# EasyEDA Pro project DC_MOTOR_DRIVER_V2.0.epro

# Schematic sheet_2

## Sheets
1 Sheet_1
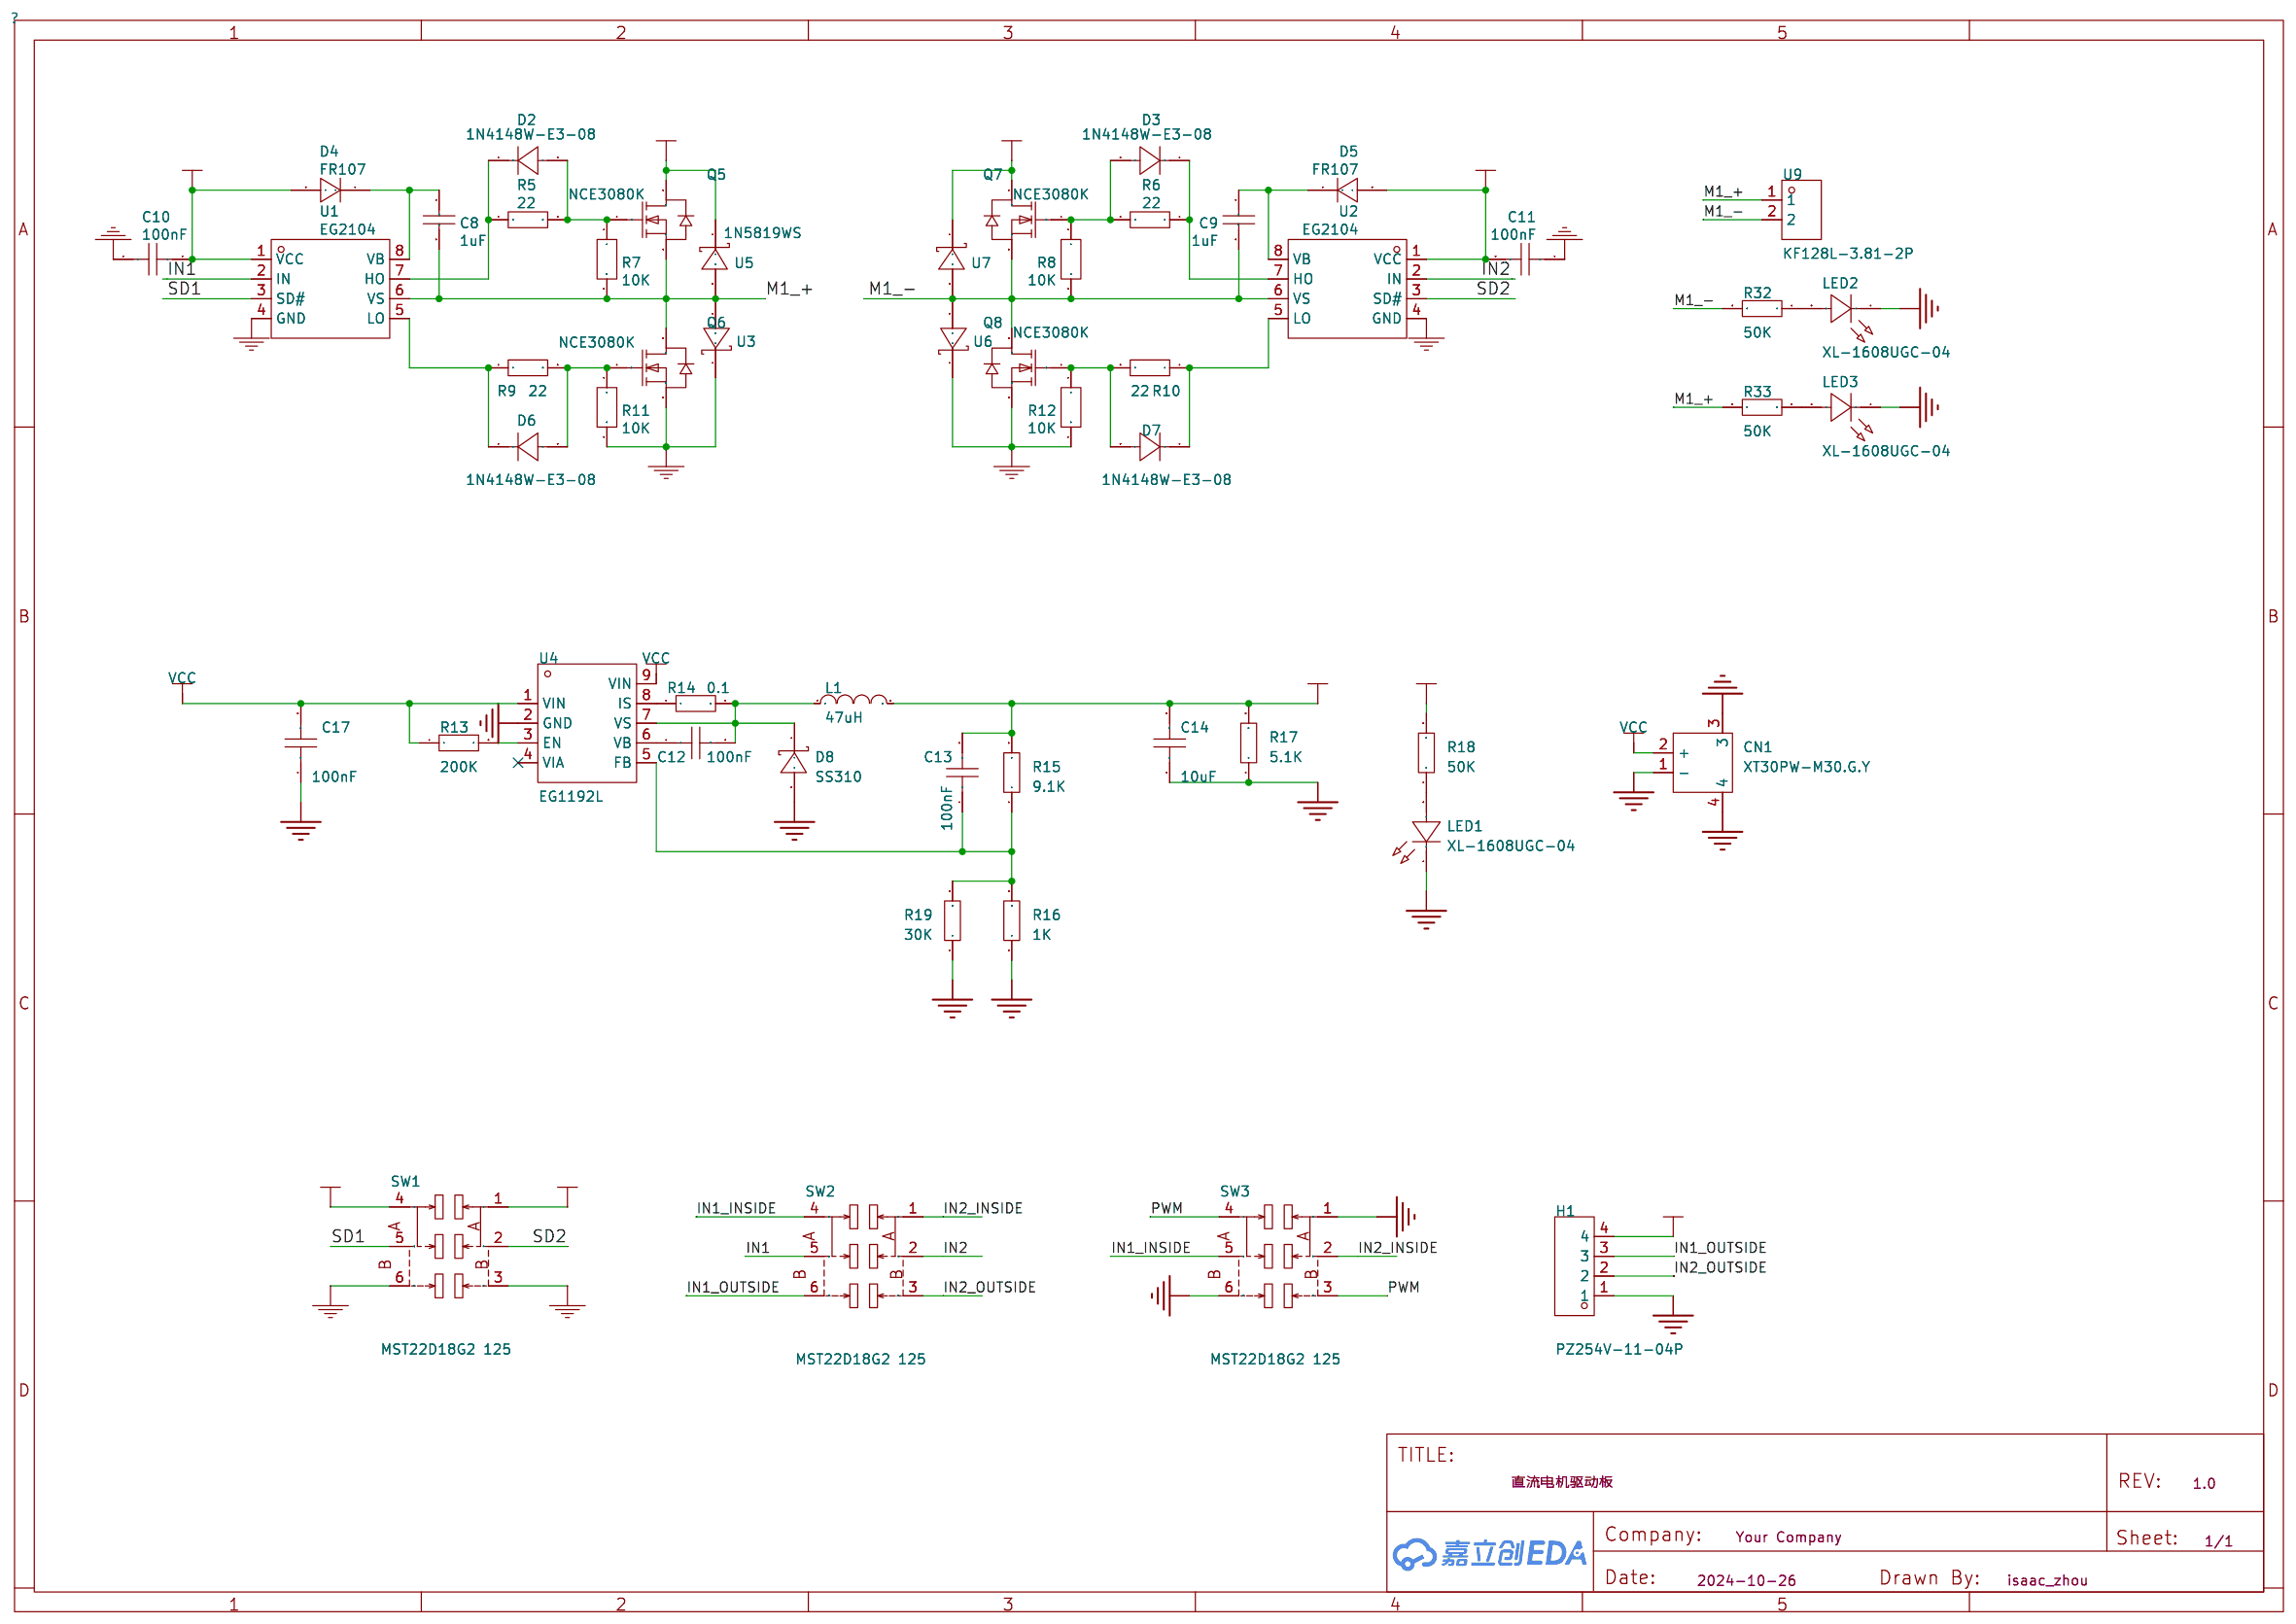
[diagram p0: Sheet_1]
2 PWM: Create Date: 2024-11-04; Page Name: PWM; Project Name: 直流电机驱动板; Schematic Name: New Project; Update Date: 2024-11-04; Company: 嘉立创EDA; Page Size: A4; Version: V1.0
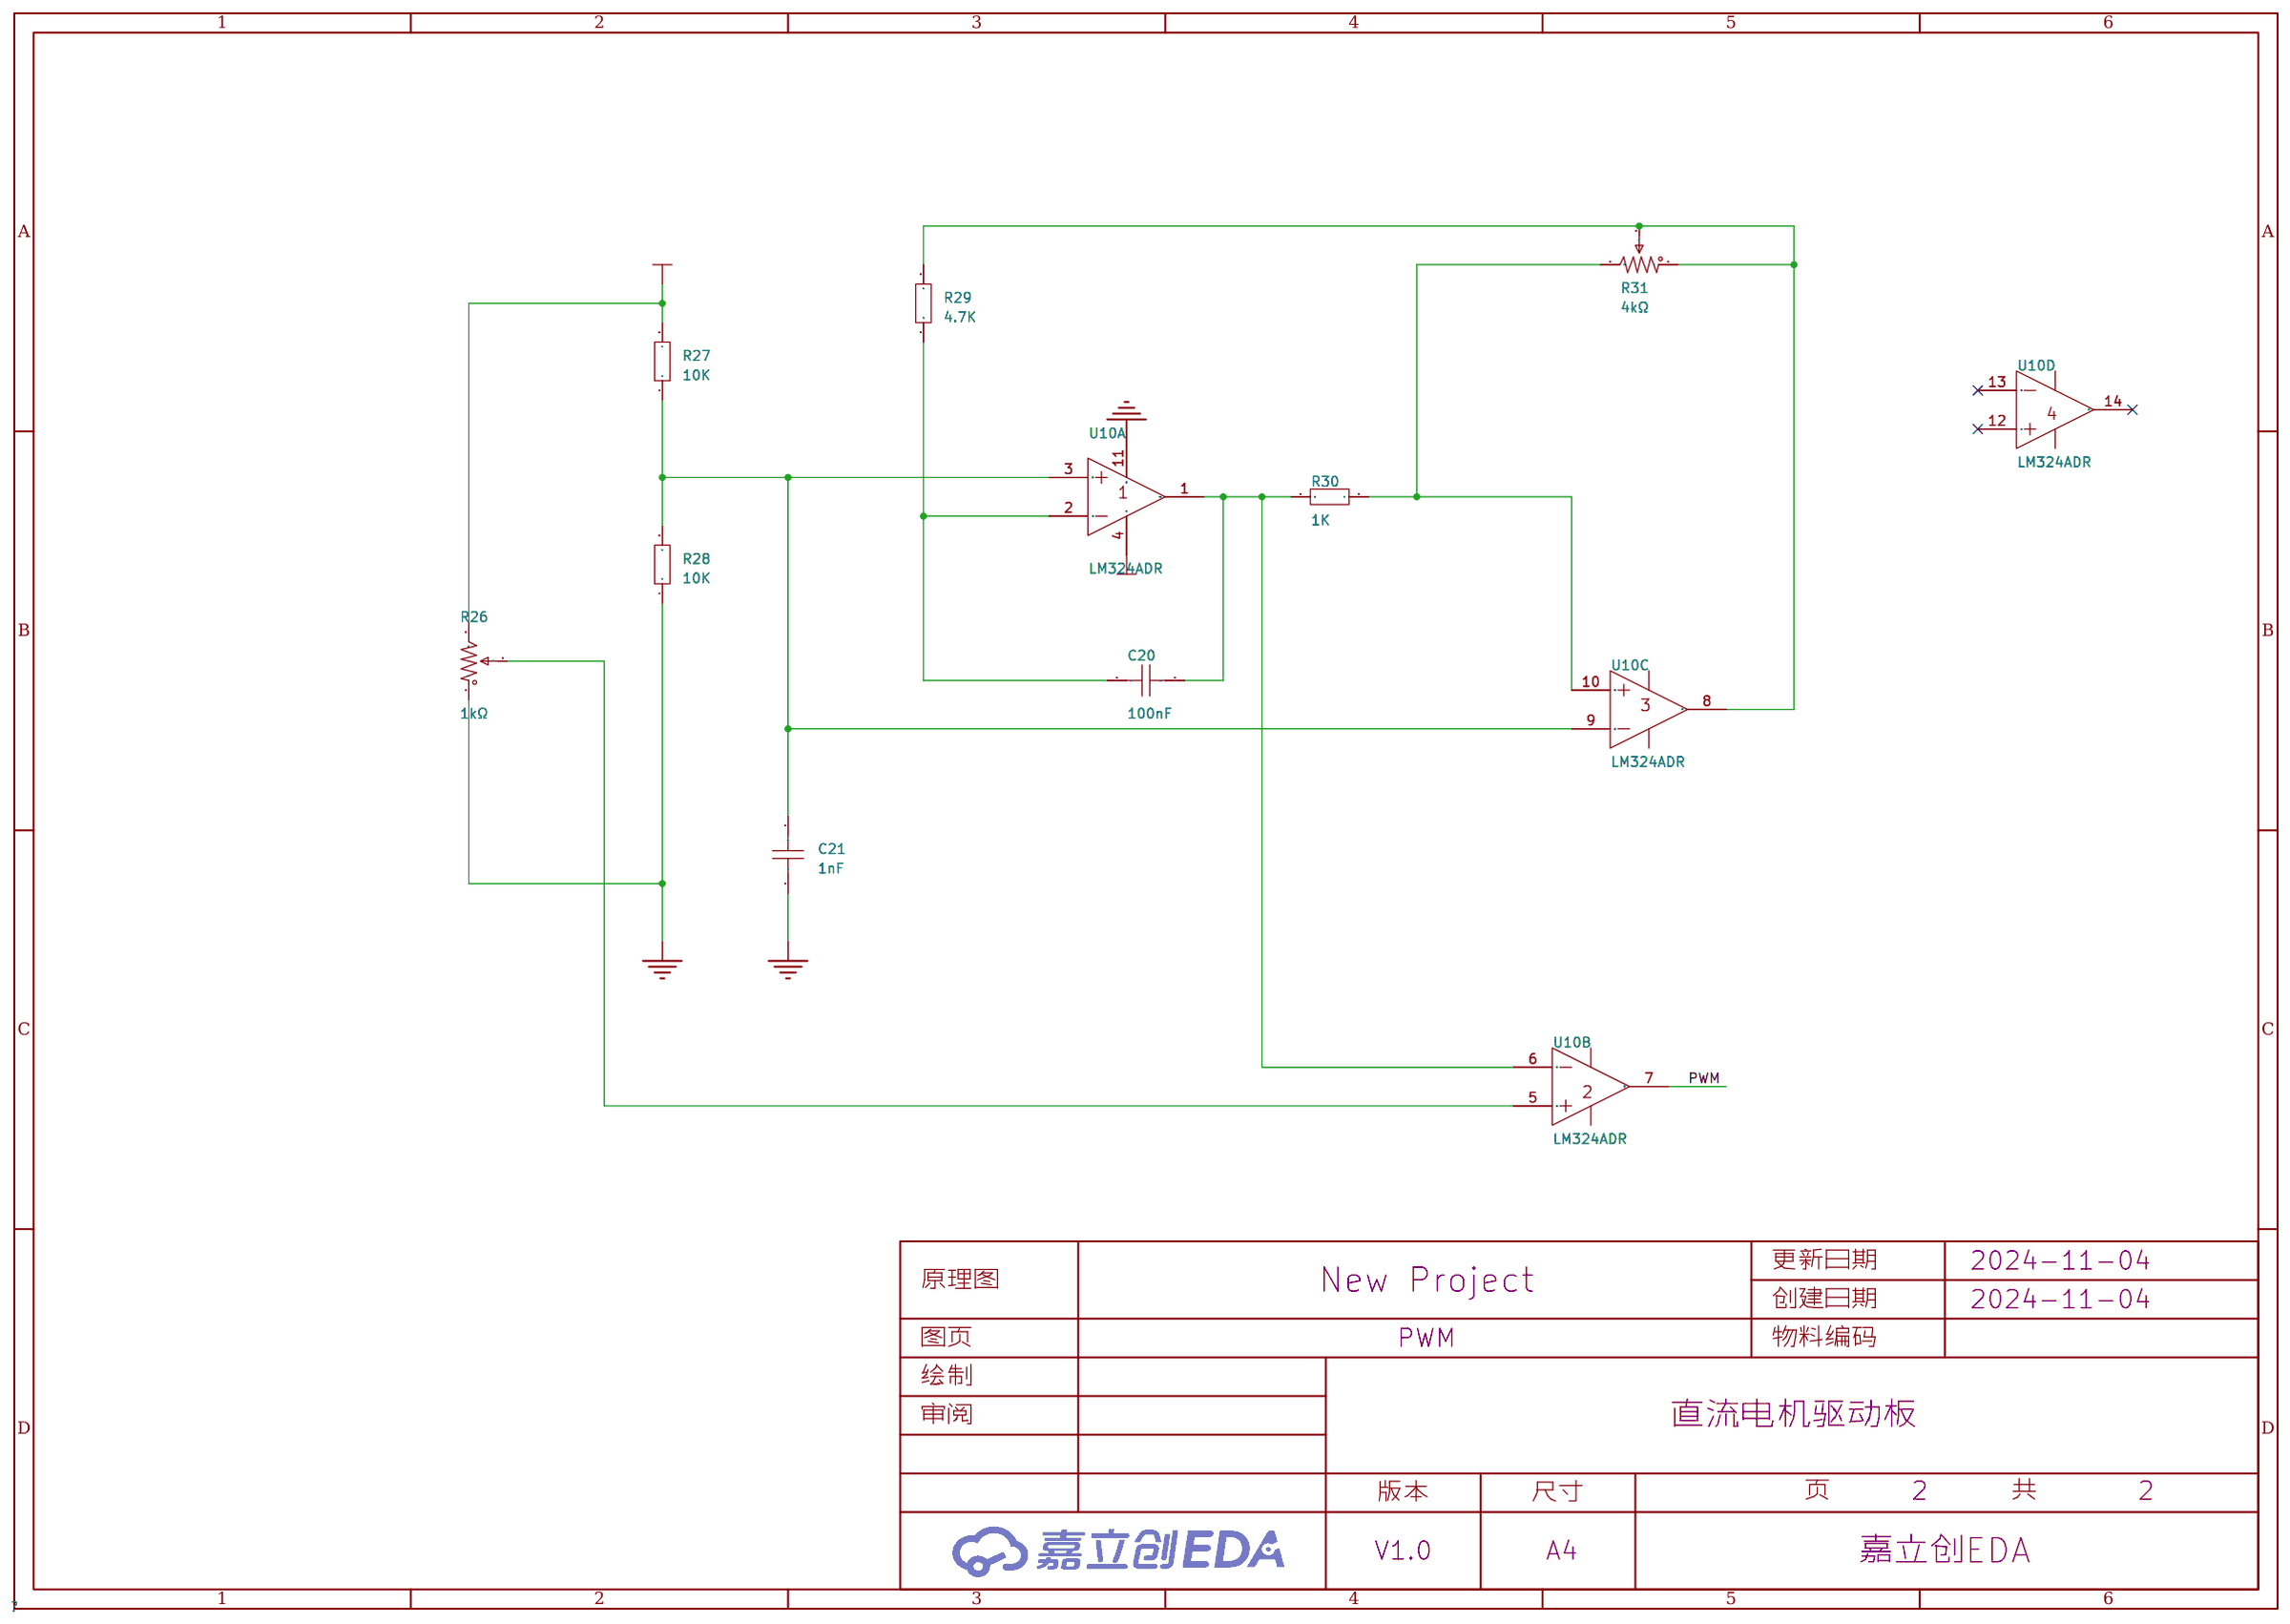
[diagram p1: PWM]

## Parts
sheet PWM
C20  100nF  [C0603]
C21  1nF  [C0603]
R26  1kΩ  [RES-ADJ-TH_3362P]
R27  10K  [R0603]
R28  10K  [R0603]
R29  4.7K  [R0603]
R30  1K  [R0603]
R31  4kΩ  [RES-ADJ-TH_3362P]
U10  LM324ADR  [SOP-14_L8.6-W3.9-P1.27-LS6.0-BL]  (sections 1,2,3,4)
sheet Sheet_1
C8  1uF  [C0603]
C9  1uF  [C0603]
C10  100nF  [C0603]
C11  100nF  [C0603]
C12  100nF  [C0603]
C13  100nF  [C0603]
C14  10uF  [C0603]
C17  100nF  [C0603]
CN1  XT30PW-M30.G.Y  [CONN-TH_XT30PW-M]
D2  1N4148W-E3-08  [SOD-123_L2.8-W1.8-LS3.7-RD]
D3  1N4148W-E3-08  [SOD-123_L2.8-W1.8-LS3.7-RD]
D4  FR107  [SOD-123FL_L2.7-W1.8-LS3.8-RD]
D5  FR107  [SOD-123FL_L2.7-W1.8-LS3.8-RD]
D6  1N4148W-E3-08  [SOD-123_L2.8-W1.8-LS3.7-RD]
D7  1N4148W-E3-08  [SOD-123_L2.8-W1.8-LS3.7-RD]
D8  SS310  [SMA_L4.3-W2.6-LS5.2-RD]
H1  PZ254V-11-04P  [HDR-TH_4P-P2.54-V-M]
L1  47uH  [IND-SMD_L7.3-W6.6]
LED1  XL-1608UGC-04  [LED0603-RD_GREEN]
LED2  XL-1608UGC-04  [LED0603-RD_GREEN]
LED3  XL-1608UGC-04  [LED0603-RD_GREEN]
Q5  NCE3080K  [TO-252-2_L6.6-W6.1-P4.57-LS9.9-TL-CW]
Q6  NCE3080K  [TO-252-2_L6.6-W6.1-P4.57-LS9.9-TL-CW]
Q7  NCE3080K  [TO-252-2_L6.6-W6.1-P4.57-LS9.9-TL-CW]
Q8  NCE3080K  [TO-252-2_L6.6-W6.1-P4.57-LS9.9-TL-CW]
R5  22  [R0603]
R6  22  [R0603]
R7  10K  [R0603]
R8  10K  [R0603]
R9  22  [R0603]
R10  22  [R0603]
R11  10K  [R0603]
R12  10K  [R0603]
R13  200K  [R0603]
R14  0.1  [R0603]
R15  9.1K  [R0603]
R16  1K  [R0603]
R17  5.1K  [R0603]
R18  50K  [R0603]
R19  30K  [R0603]
R32  50K  [R0603]
R33  50K  [R0603]
SW1  MST22D18G2 125  [SW-SMD_MST22D18G2]
SW2  MST22D18G2 125  [SW-SMD_MST22D18G2]
SW3  MST22D18G2 125  [SW-SMD_MST22D18G2]
U1  EG2104  [SOP-8_L5.0-W4.0-P1.27-LS6.2-BL]
U2  EG2104  [SOP-8_L5.0-W4.0-P1.27-LS6.2-BL]
U3  1N5819WS  [SOD-323_L1.8-W1.3-LS2.5-RD]
U4  EG1192L  [ESOP-8_L4.9-W3.9-P1.27-LS6.0-BL-EP]
U5  1N5819WS  [SOD-323_L1.8-W1.3-LS2.5-RD]
U6  1N5819WS  [SOD-323_L1.8-W1.3-LS2.5-RD]
U7  1N5819WS  [SOD-323_L1.8-W1.3-LS2.5-RD]
U9  KF128L-3.81-2P  [CONN-TH_P3.81_KF128L-3.81-2P]

## Library data of the parts
C14 C20 C21 = CAP_0603: Supplier Footprint: 0603
R26 R31 = 3362P-1-102: 阻值:1kΩ;精度:±10%;; LCSC Part Name: 1kΩ ±10%; Supplier Part: C118947; Manufacturer: BOCHEN(博晨); Supplier Footprint: 插件; JLCPCB Part Class: 扩展库; Datasheet: https://atta.szlcsc.com/upload/public/pdf/source/20171114/C118947_15106326631901117436.pdf; Supplier: LCSC; Tolerance: ±10%
R13 R17 R27-R30 = Res_0603: Supplier Footprint: 0603
U10 = LM324ADR_C2837469: Supplier Part: C2837469; Manufacturer: UMW(友台半导体); Supplier Footprint: SOP-14; JLCPCB Part Class: 扩展库; Datasheet: https://atta.szlcsc.com/upload/public/pdf/source/20240802/7FC25ED9797EBD5FD4F47818FEC11BE7.pdf; Supplier: LCSC
C8 C9 = 1uF: Supplier: LCSC; Manufacturer Part: CL21F105ZOFNNNE; Manufacturer: SAMSUNG; Supplier Part: C14663; JLCPCB Part Class: Extended Part
C10 = 100nF: Supplier: LCSC; Supplier Part: C599851; Manufacturer: KEMET; Manufacturer Part: C0805C104K4RAC7800
C11 = 100nF: Supplier: LCSC; Supplier Part: C14663; Manufacturer: KEMET; Manufacturer Part: C0805C104K4RAC7800
C12 C13 C17 = CAP_0603: Supplier Footprint: 0603; Supplier Part: C14663
CN1 = XT30PW-M30.G.Y: 类别:-;类型1:-;; LCSC Part Name: AMASS(艾迈斯)航模插头 卧式弯脚 XT30PW-M公头; Supplier Part: C431092; Manufacturer: AMASS(艾迈斯); JLCPCB Part Class: 扩展库; Datasheet: https://atta.szlcsc.com/upload/public/pdf/source/20220222/6A9F22F7850E25B33E1BE430ADF8560B.pdf; Supplier: LCSC; Type: 航模插头; RatedVoltage: DC 500V; InterfaceType: 公头; RatedCurrent: 15A; RecommendedWireGauge: 16/18/20AWG; contact resistance: 1.2mΩ; specifications: 2pin
D2 D3 D6 D7 = 1N4148W-E3-08: 二极管配置:-;正向压降(Vf):1.2V@100mA;直流反向耐压(Vr):75V;平均整流电流(Io):150mA;功率:350mW;反向恢复时间(trr):4ns;; LCSC Part Name: 电压:75V 电流:150mA; Supplier Part: C241939; Manufacturer: VISHAY(威世); Supplier Footprint: SOD-123; JLCPCB Part Class: Extended Part; Datasheet: https://atta.szlcsc.com/upload/public/pdf/source/20180719/C241939_AB5601D33C939ACDC04F46818C9B4736.pdf; Supplier: LCSC; Forward Voltage (Vf@If): 1.2V@100mA; Reverse Voltage (Vr): 75V; Average Rectified Current (Io): 150mA; Power Dissipation: 350mW; Reverse Leakage Current: 100uA@100V; Reverse Recovery Time (trr): 4ns
D4 D5 = FR107_C2760867: 二极管配置:独立式;正向压降(Vf):1.3V@1A;直流反向耐压(Vr):1kV;平均整流电流(Io):1A;反向恢复时间(trr):500ns;; LCSC Part Name: 电压:1kV 电流:1A; Supplier Part: C2760867; Manufacturer: Slkor(萨科微); Supplier Footprint: SOD-123FL; JLCPCB Part Class: Extended Part; Datasheet: https://atta.szlcsc.com/upload/public/pdf/source/20210316/C2760867_0B45AFF5F62837EEEC945A80EBBE02AA.pdf; Supplier: LCSC; Diode Configuration: 独立式; Forward Voltage (Vf@If): 1.3V@1A; Reverse Voltage (Vr): 1kV; Average Rectified Current (Io): 1A; Reverse Leakage Current: 5uA@1kV; Reverse Recovery Time (trr): 500ns; Operating Temperature: -55℃~+150℃@(Tj)
D8 = SS310_C15874: 二极管配置:独立式;正向压降(Vf):850mV@3A;直流反向耐压(Vr):100V;整流电流:3A;; LCSC Part Name: 电压:100V 电流:3A; Supplier Part: C15874; Manufacturer: MDD(辰达半导体); Supplier Footprint: SMA(DO-214AC); JLCPCB Part Class: 扩展库; Datasheet: https://atta.szlcsc.com/upload/public/pdf/source/20230314/A80AE34493C69B89E2F4B1712F433538.pdf; Supplier: LCSC; Diode Configuration: 独立式; Forward Voltage (Vf@If): 850mV@3A; Reverse Voltage (Vr): 100V; Rectified Current: 3A; Reverse Leakage Current (Ir): 500uA@100V
H1 = PZ254V-11-04P: 插针结构:1x4P;间距:2.54mm;行距:-;圆针/方针:方针;安装类型:直插;排数:单排;总PIN位数:4P;额定电流:3A;额定电压:250V;配合针长度:6mm;塑高:2.5mm;端接针长度:3mm;触头材质:-;工作温度范围:-40℃~+105℃;颜色:黑色;; LCSC Part Name: 间距:2.54mm 1x4P 直插 方针; Supplier Part: C2691448; Manufacturer: XFCN(兴飞); Supplier Footprint: 插件,P=2.54mm; JLCPCB Part Class: 扩展库; Datasheet: https://atta.szlcsc.com/upload/public/pdf/source/20200309/C492403_F9F19131791D08044AD4F84F8E751A34.pdf; Supplier: LCSC; Pin Structure: 1x4P; Pitch: 2.54mm; Circluar Pins/Square Pins: 方针; Mounting Type: 直插; Number of Rows: 单排; Number of Pins: 4P; Current Rating (Max): 3A; Voltage Rating (Max): 250V; Length of Mating Pin: 6mm; Insulation Height: 2.5mm; Length of End Connection Pin: 3mm; Operating Temperature Range: -40℃~+105℃; Color: 黑色
L1 = CKST0603-47uH/M: 电感值:47uH;精度:±20%;类型:一体成型电感;; LCSC Part Name: 47uH ±20%; Supplier Part: C3002643; Manufacturer: CENKER(岑科); Supplier Footprint: 0603; JLCPCB Part Class: Extended Part; Datasheet: https://atta.szlcsc.com/upload/public/pdf/source/20220510/B48FE89972EB9627500571FF6CB43AFA.pdf; Supplier: LCSC; Tolerance: ±20%; Type: 一体成型电感
LED1-LED3 = XL-1608UGC-04: 灯头类型:-;发光颜色:翠绿色;正向电压(VF):-;功率:80mW;正向电流:25mA;主波长:516nm~525nm;二极管配置:独立二极管;透镜颜色:无色透明透镜;色温:-;发光强度:-;发光角度:120°;载带方式:正贴;工作温度:-30℃~+85℃;; Supplier Part: C965804; Manufacturer: XINGLIGHT(成兴光); Supplier Footprint: 0603; JLCPCB Part Class: 扩展库; Datasheet: https://atta.szlcsc.com/upload/public/pdf/source/20221102/520D6E465E5CFD1609C8A4DBC80D4018.pdf; Supplier: LCSC; Emitted Color: 翠绿色; Power Dissipation: 80mW; Forward Current: 25mA; Dominant Wavelength: 516nm~525nm; Peak Wavelength: 534nm; Diode Configuration: 独立二极管; Lens Color: 无色透明透镜; Viewing Angle: 120°; Mounting Sytle: 正贴; Operating Temperature: -30℃~+85℃
Q5-Q8 = NCE3080K: 类型:N沟道;漏源电压(Vdss):30V;连续漏极电流(Id):80A;功率(Pd):83W;导通电阻(RDS(on)@Vgs,Id):6.5mΩ@10V,30A;阈值电压(Vgs(th)@Id):3V@250uA;; LCSC Part Name: N沟道 耐压:30V 电流:80A; Supplier Part: C108901; Manufacturer: NCE(无锡新洁能); Supplier Footprint: TO-252-2(DPAK); JLCPCB Part Class: Extended Part; Datasheet: https://atta.szlcsc.com/upload/public/pdf/source/20170505/1493957853878.pdf; Supplier: LCSC; Type: N沟道; Drain Source Voltage (Vdss): 30V; Continuous Drain Current (Id): 80A; Power Dissipation (Pd): 83W; Drain Source On Resistance (RDS(on)@Vgs,Id): 6.5mΩ@10V,30A; Gate Threshold Voltage (Vgs(th)@Id): 3V@250uA
R5 R9 = 22: Supplier: LCSC; Manufacturer: UniOhm; Manufacturer Part: 0805W8F220JT5E; Supplier Part: C17561; JLCPCB Part Class: Basic Part
R6 R10 = 22: Supplier: LCSC; Manufacturer: UniOhm; Manufacturer Part: 0805W8F220JT5E; Supplier Part: C21190; JLCPCB Part Class: Basic Part
R7 R8 R11 R12 = 10K: Supplier: LCSC; Supplier Part: C21190; Manufacturer: Uniroyal Elec; Manufacturer Part: 0805W8F1002T5E; JLCPCB Part Class: Extended Part
R14-R16 R18 R19 R32 R33 = Res_0603: Supplier Footprint: 0603; Supplier Part: C21190
SW1-SW3 = MST22D18G2 125: 电路结构:双刀双掷;安装方式:立贴;开关颜色:黑色;额定电流(DC):100mA;额定电压(DC):12V;机械寿命:1万次;; LCSC Part Name: 拨动开关/两档立式 6脚贴片 柄长2.0mm 大六立贴 9.1*3.5mm; Supplier Part: C2906280; Manufacturer: SHOU HAN(首韩); Supplier Footprint: SMD; JLCPCB Part Class: 扩展库; Datasheet: https://atta.szlcsc.com/upload/public/pdf/source/20211019/449AD4EDF23AADA7A5C4E3C063EDBB30.pdf; Supplier: LCSC; Circuit: 双刀双掷; Pin Style: 鸥翼型; Mounting Style: 立贴; Actuator Color: 黑色; Current Rating (DC): 100mA; Voltage Rating (DC): 12V; Mechanical Life: 1万次; Operating Temperature: -25℃~+70℃
U1 U2 = EG2104: 高性价比, 600V，半桥式Nmos预驱动器; Supplier Part: C186697; Manufacturer: EG(屹晶微); Supplier Footprint: SOP-8; JLCPCB Part Class: Extended Part; Datasheet: https://atta.szlcsc.com/upload/public/pdf/source/20220627/4CCFA0CAB664067FEE4AF87E4129127F.pdf; Supplier: LCSC
U3 U5-U7 = 1N5819WS_C191023: 正向压降(Vf):600mV@1A;直流反向耐压(Vr):40V;平均整流电流(Io):1A;; LCSC Part Name: 电压:40V 电流:1A; Supplier Part: C191023; Manufacturer: Hottech(合科泰); Supplier Footprint: SOD-323; JLCPCB Part Class: Basic Part; Datasheet: https://atta.szlcsc.com/upload/public/pdf/source/20220428/3CB86FD8D28D653594B4E35F9D5AEFD9.pdf; Supplier: LCSC; Forward Voltage (Vf@If): 600mV@1A; Reverse Voltage (Vr): 40V; Average Rectified Current (Io): 1A
U4 = EG1192L: 零功耗使能降压 DCDC 电源芯片; LCSC Part Name: 零功耗使能降压 DCDC 电源芯片; Supplier Part: C2987436; Manufacturer: EG(屹晶微); Supplier Footprint: ESOP-8; JLCPCB Part Class: 扩展库; Datasheet: https://atta.szlcsc.com/upload/public/pdf/source/20220401/C4C4A2A7D21C9FC2776ECF40A6ED664C.pdf; Supplier: LCSC
U9 = KF128L-3.81-2P: 结构:1x2P;间距:3.81mm;颜色:绿色;安装方式:直插;额定电流:10A;额定电压:300V;排数:1;线规 - AWG:16~26;线规 - 平方毫米:1;每排PIN数:2;工作温度范围:-40℃~+105℃;; LCSC Part Name: 3.81mm 1x2P 排数:1 每排P数:2 直插; Supplier Part: C474932; Manufacturer: KEFA(科发); Supplier Footprint: 插件,P=3.81mm; JLCPCB Part Class: 扩展库; Datasheet: https://atta.szlcsc.com/upload/public/pdf/source/20240118/B0177BAB216696F90B0D16B51EF273F7.pdf; Supplier: LCSC; Structure: 1x2P; Pitch: 3.81mm; Color: 绿色; Mounting Style: 直插; Current Rating (Max): 10A; Voltage Rating (Max): 300V; Number of Pins: 2P; Number of Rows: 1; Wire Gauge - AWG: 16~26; Wire Gauge - mm2: 1; Number of PINs Per Row: 2; Operating Temperature Range: -40℃~+105℃

## Nets
12V: C10.2 C11.2 C13.2 C14.2 D4.2(A) D5.2(A) H1.4 L1.2 Q5.2(D) Q7.2(D) R15.2 R17.2 R18.2 R26.3 R27.2 SW1.1 SW1.4 U1.1(VCC) U2.1(VCC) U5.1(K) U7.1(K) U10.4(VCC)
GND: C10.1 C11.1 C14.1 C17.1 C21.1 CN1.1(-) CN1.3 CN1.4 D8.2(A) H1.1 LED1.1(K) LED2.1(K) LED3.1(K) Q6.3(S) Q8.3(S) R11.2 R12.2 R16.1 R17.1 R19.1 R26.1 R28.1 SW1.3 SW1.6 SW3.1 SW3.6 U1.4(GND) U2.4(GND) U3.1(K) U4.2(GND) U6.1(K) U10.11(GND)
VCC: C17.2 CN1.2(+) R13.1 U4.1(VIN) U4.9(VIN)
IN1: SW2.5 U1.2(IN)
IN1_INSIDE: SW2.4 SW3.5
IN1_OUTSIDE: H1.3 SW2.6
IN2: SW2.2 U2.2(IN)
IN2_INSIDE: SW2.1 SW3.2
IN2_OUTSIDE: H1.2 SW2.3
M1_+: C8.2 Q5.3(S) Q6.2(D) R7.2 R33.2 U1.6(VS) U3.2(A) U5.2(A) U9.1
M1_-: C9.2 Q7.3(S) Q8.2(D) R8.2 R32.2 U2.6(VS) U6.2(A) U7.2(A) U9.2
PWM: SW3.3 SW3.4 U10.7(2OUT)
SD1: SW1.5 U1.3(SD#)
SD2: SW1.2 U2.3(SD#)
$1N6: C9.1 D5.1(K) U2.8(VB)
$1N7: D3.1(K) R6.1 U2.7(HO)
$1N8: D3.2(A) Q7.1(G) R6.2 R8.1
$1N10: D7.1(K) R10.1 U2.5(LO)
$1N13: D7.2(A) Q8.1(G) R10.2 R12.1
$1N16: D6.2(A) Q6.1(G) R9.2 R11.1
$1N17: C8.1 D4.1(K) U1.8(VB)
$1N19: D6.1(K) R9.1 U1.5(LO)
$1N20: D2.2(A) Q5.1(G) R5.2 R7.1
$1N21: D2.1(K) R5.1 U1.7(HO)
$1N1054: R13.2 U4.3(EN)
$1N1080: R14.1 U4.8(IS)
$1N1130: C12.1 U4.6(VB)
$1N1292: C12.2 D8.1(K) L1.1 R14.2 U4.7(VS)
$1N2120: LED1.2(A) R18.1
$1N2220: C13.1 R15.1 R16.2 R19.2 U4.5(FB)
$1N11802: LED2.2(A) R32.1
$1N11897: LED3.2(A) R33.1
$2N434: R26.2 U10.5(2IN+)
$2N438: R29.2 R31.1 R31.2 U10.8(3OUT)
$2N446: R30.1 R31.3 U10.10(3IN+)
$2N452: C20.2 R30.2 U10.1(1OUT) U10.6(2IN-)
$2N464: C21.2 R27.1 R28.2 U10.3(1IN+) U10.9(3IN-)
$2N473: C20.1 R29.1 U10.2(1IN-)

Not connected (* = marked no-connect by the designer): U4 4(VIA)*; U10 12(4IN+)* 13(4IN-)* 14(4OUT)*

# Board PCB1
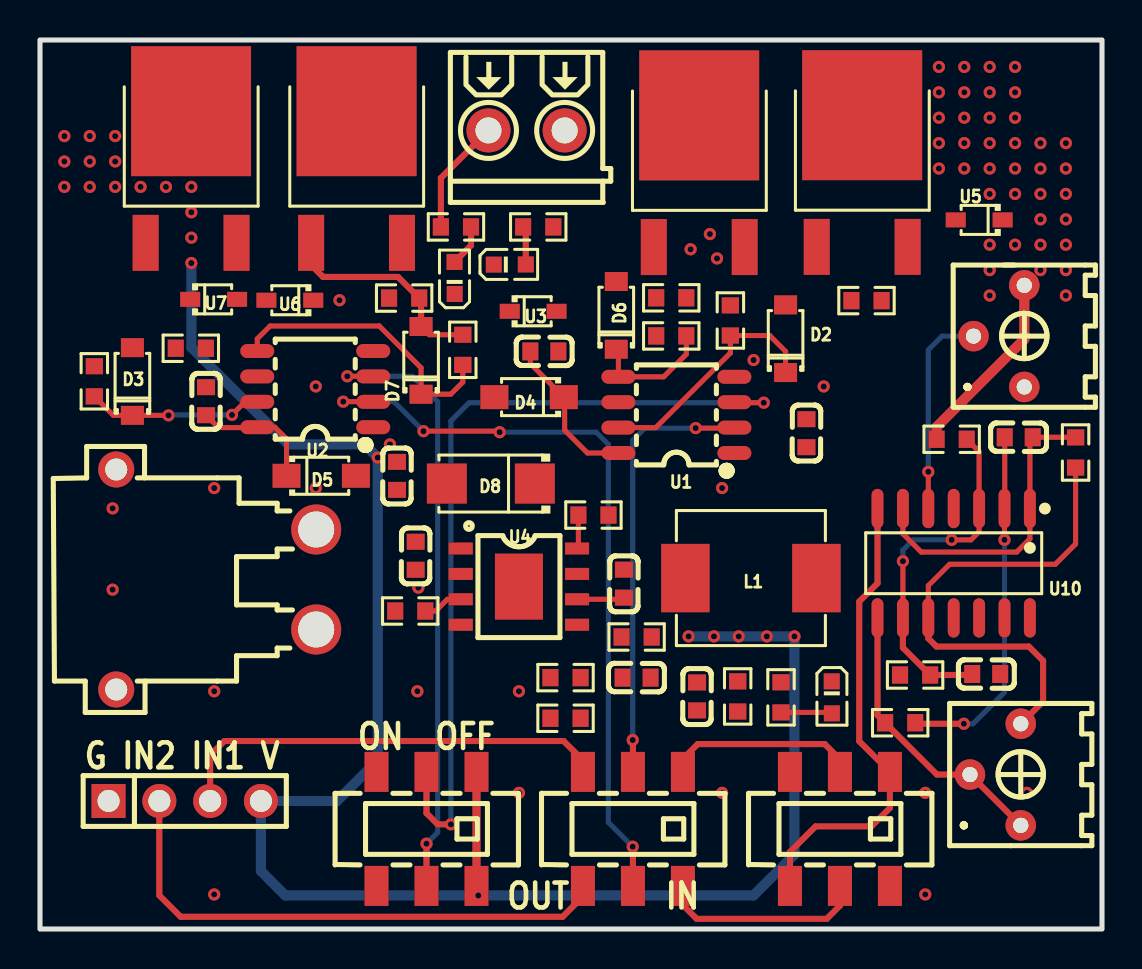
[diagram p2: board, top side]
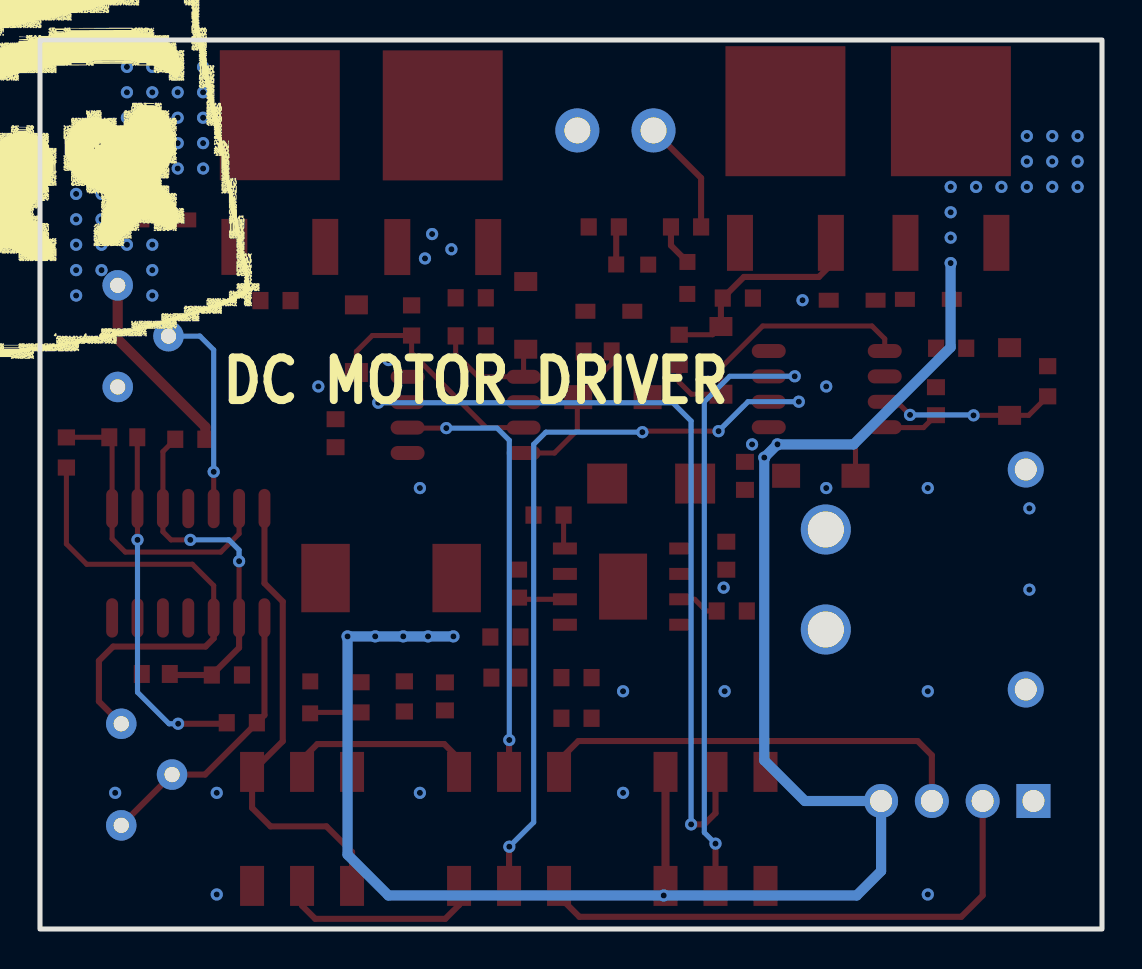
[diagram p3: board, bottom side, seen from below]

Outline 53.11 x 44.45 mm; copper layers: Top Layer, Bottom Layer. Coordinates in mm from the lower left corner of the outline.
Outline path: rectangle 0,44.45 53.11,0
Stack: Top Layer 0.035mm / Dielectric1 1.51mm FR4 er 4.5 / Bottom Layer 0.035mm

## Design rules (mm)
template: 自定义配置
spacing copperThickness1oz (default): track to track 0.102, other pairs 0.152 to 0.3
spacing copperThickness2oz: track to track 0.203, other pairs 0.152 to 0.3
track width copperThickness1oz (default): min 0.127, default 0.254, max 2.54
track width copperThickness2oz: min 0.203, default 0.254, max 2.54
differential pair differentialPair (default): width min 0.127, default 0.254, max 2.54; gap min 0.152, default 0.152
via viaSize (default): diameter min 0.5, default 0.61, max 10; hole min 0.3, default 0.305, max 6.3

## Placement (name value [footprint] x y rotation side)
C8  1uF  [C0603]  25.22 28.88 0 top
C9  1uF  [C0603]  8.31 26.39 90 top
C10  100nF  [C0603]  38.33 24.79 270 top
C11  100nF  [C0603]  17.86 22.66 90 top
C12  100nF  [C0603]  29.2 17.27 90 top
C13  100nF  [C0603]  29.84 12.57 0 top
C14  10uF  [C0603]  32.86 11.63 90 top
C17  100nF  [C0603]  18.79 18.66 90 top
C20  100nF  [C0603]  48.95 24.59 0 top
C21  1nF  [C0603]  47.32 12.75 180 top
CN1  XT30PW-M30.G.Y  [CONN-TH_XT30PW-M]  8.81 17.48 270 top
D2  1N4148W-E3-08  [SOD-123_L2.8-W1.8-LS3.7-RD]  37.29 29.52 90 top
D3  1N4148W-E3-08  [SOD-123_L2.8-W1.8-LS3.7-RD]  4.62 27.37 90 top
D4  FR107  [SOD-123FL_L2.7-W1.8-LS3.8-RD]  24.46 26.59 180 top
D5  FR107  [SOD-123FL_L2.7-W1.8-LS3.8-RD]  14.06 22.66 0 top
D6  1N4148W-E3-08  [SOD-123_L2.8-W1.8-LS3.7-RD]  28.82 30.68 90 top
D7  1N4148W-E3-08  [SOD-123_L2.8-W1.8-LS3.7-RD]  19.06 28.43 90 top
D8  SS310  [SMA_L4.3-W2.6-LS5.2-RD]  22.55 22.27 180 top
H1  PZ254V-11-04P  [HDR-TH_4P-P2.54-V-M]  7.24 6.4 0 top
L1  47uH  [IND-SMD_L7.3-W6.6]  35.55 17.55 180 top
LED1  XL-1608UGC-04  [LED0603-RD_GREEN]  39.6 11.58 270 top
LED2  XL-1608UGC-04  [LED0603-RD_GREEN]  20.74 32.55 90 top
LED3  XL-1608UGC-04  [LED0603-RD_GREEN]  23.5 33.22 0 top
Q5  NCE3080K  [TO-252-2_L6.6-W6.1-P4.57-LS9.9-TL-CW]  41.12 37.4 90 top
Q6  NCE3080K  [TO-252-2_L6.6-W6.1-P4.57-LS9.9-TL-CW]  32.97 37.39 90 top
Q7  NCE3080K  [TO-252-2_L6.6-W6.1-P4.57-LS9.9-TL-CW]  7.56 37.6 90 top
Q8  NCE3080K  [TO-252-2_L6.6-W6.1-P4.57-LS9.9-TL-CW]  15.83 37.6 90 top
R5  22  [R0603]  34.53 30.43 90 top
R6  22  [R0603]  2.72 27.39 90 top
R7  10K  [R0603]  41.33 31.42 0 top
R8  10K  [R0603]  7.54 29.04 0 top
R9  22  [R0603]  31.57 29.65 180 top
R10  22  [R0603]  21.14 28.96 90 top
R11  10K  [R0603]  31.57 31.56 0 top
R12  10K  [R0603]  18.21 31.55 180 top
R13  200K  [R0603]  18.52 15.9 0 top
R14  0.1  [R0603]  27.68 20.7 0 top
R15  9.1K  [R0603]  29.84 14.6 0 top
R16  1K  [R0603]  26.28 10.54 0 top
R17  5.1K  [R0603]  34.89 11.63 90 top
R18  50K  [R0603]  37.06 11.58 90 top
R19  30K  [R0603]  26.28 12.57 0 top
R26  1kΩ  [RES-ADJ-TH_3362P]  47.96 29.64 90 top
R27  10K  [R0603]  45.59 24.49 180 top
R28  10K  [R0603]  43.76 12.7 0 top
R29  4.7K  [R0603]  43.02 10.31 180 top
R30  1K  [R0603]  51.79 23.83 90 top
R31  4kΩ  [RES-ADJ-TH_3362P]  47.78 7.72 90 top
R32  50K  [R0603]  20.8 35.1 180 top
R33  50K  [R0603]  24.92 35.1 0 top
SW1  MST22D18G2 125  [SW-SMD_MST22D18G2]  19.33 5 180 top
SW2  MST22D18G2 125  [SW-SMD_MST22D18G2]  29.65 5 180 top
SW3  MST22D18G2 125  [SW-SMD_MST22D18G2]  40 5 180 top
U1  EG2104  [SOP-8_L5.0-W4.0-P1.27-LS6.2-BL]  31.83 25.7 90 top
U2  EG2104  [SOP-8_L5.0-W4.0-P1.27-LS6.2-BL]  13.77 26.99 90 top
U3  1N5819WS  [SOD-323_L1.8-W1.3-LS2.5-RD]  24.66 30.89 0 top
U4  EG1192L  [ESOP-8_L4.9-W3.9-P1.27-LS6.0-BL-EP]  23.95 17.12 270 top
U5  1N5819WS  [SOD-323_L1.8-W1.3-LS2.5-RD]  46.97 35.45 180 top
U6  1N5819WS  [SOD-323_L1.8-W1.3-LS2.5-RD]  12.5 31.44 180 top
U7  1N5819WS  [SOD-323_L1.8-W1.3-LS2.5-RD]  8.68 31.48 0 top
U9  KF128L-3.81-2P  [CONN-TH_P3.81_KF128L-3.81-2P]  24.33 39.93 180 top
U10  LM324ADR  [SOP-14_L8.6-W3.9-P1.27-LS6.0-BL]  45.69 18.29 180 top

## Footprints (pads in the part's own frame, mm; a bottom-side part is the same pattern mirrored in y, then rotated)
C0603
  rect 0.8x0.9 smd: 1(-0.7,0) 2(0.7,0)
CONN-TH_P3.81_KF128L-3.81-2P
  round 2.2 hole 1.3: 1(-1.905,0) 2(1.905,0)
CONN-TH_XT30PW-M
  round 2.5 hole 1.8: 1(-2.5,5) 2(2.5,5)
  round 1.8 hole 1.1: 3(5.5,-5) 4(-5.5,-5)
ESOP-8_L4.9-W3.9-P1.27-LS6.0-BL-EP
  rect 0.6x1.2 smd: 1(-1.905,-2.909) 2(-0.635,-2.909) 3(0.635,-2.909) 4(1.905,-2.909) 5(1.905,2.909) 6(0.635,2.909) 7(-0.635,2.909) 8(-1.905,2.909)
  rect 3.3x2.4 smd: 9(0,0)
HDR-TH_4P-P2.54-V-M
  rect 1.7x1.7 hole 1.1: 1(-3.81,0)
  round 1.7 hole 1.1: 2(-1.27,0) 3(1.27,0) 4(3.81,0)
IND-SMD_L7.3-W6.6
  rect 2.424x3.42 smd: 1(3.278,0) 2(-3.278,0)
LED0603-RD_GREEN
  rect 0.8x0.8 smd: 1(-0.799,-0.004) 2(0.799,0.004)
R0603
  rect 0.806x0.864 smd: 1(-0.753,0) 2(0.753,0)
RES-ADJ-TH_3362P
  round 1.524 hole 0.762: 1(-2.54,-1.27) 2(0,1.27) 3(2.54,-1.27)
SMA_L4.3-W2.6-LS5.2-RD
  rect 2x2 smd: 1(-2.2,0) 2(2.2,0)
SOD-123_L2.8-W1.8-LS3.7-RD
  rect 0.95x1.15 smd: 1(-1.692,0) 2(1.692,0)
SOD-123FL_L2.7-W1.8-LS3.8-RD
  rect 1.4x1.2 smd: 1(-1.735,0) 2(1.735,0)
SOD-323_L1.8-W1.3-LS2.5-RD
  rect 1x0.75 smd: 1(-1.173,0) 2(1.173,0)
SOP-8_L5.0-W4.0-P1.27-LS6.2-BL
  oval 0.7x1.7 smd: 1(-1.905,-2.9) 2(-0.635,-2.9) 3(0.635,-2.9) 4(1.905,-2.9) 5(1.905,2.9) 6(0.635,2.9) 7(-0.635,2.9) 8(-1.905,2.9)
SOP-14_L8.6-W3.9-P1.27-LS6.0-BL
  oval 0.595x1.968 smd: 1(-3.81,-2.734) 2(-2.54,-2.734) 3(-1.27,-2.734) 4(0,-2.734) 5(1.27,-2.734) 6(2.54,-2.734) 7(3.81,-2.734) 8(3.81,2.734) 9(2.54,2.734) 10(1.27,2.734) 11(0,2.734) 12(-1.27,2.734) 13(-2.54,2.734) 14(-3.81,2.734)
SW-SMD_MST22D18G2
  rect 1.2x2 smd: 1(-2.5,2.85) 2(0,2.85) 3(2.5,2.85) 4(-2.5,-2.85) 5(0,-2.85) 6(2.5,-2.85)
TO-252-2_L6.6-W6.1-P4.57-LS9.9-TL-CW
  rect 2.8x1.3 smd: 1(-3.292,2.273) 3(-3.292,-2.273)
  rect 6.5x6 smd: 2(3.292,0)

## Nets
As in the schematic.

Pads without a net: U4 4; U10 12 13 14

## Via types
v1: diameter 0.61, hole 0.305, Top Layer to Bottom Layer, 103 vias

## Routing (per net, layer and track width the routed paths; a pad name or vN(x,y) marks a point on that pad's centre or on a via; arc(x,y) is an arc through that point)
12V: length 100.6
  Top Layer w0.406: 21.83,7.93 21.83,2.23
  Top Layer w0.508: R26.3 49.22,29.49 44.84,25.1 R27.2
  Bottom Layer w0.508: v1(32.44,14.63) v1(33.71,14.63) v1(34.94,14.63) v1(36.35,14.63) v1(37.73,14.63) 37.73,3.72 35.69,1.68 v1(21.92,1.68) 12.27,1.68 11.05,2.9 H1.4 14.86,6.4 16.89,8.43 v1(16.89,23.57) v1(16.23,24.23) 12.42,24.23 7.57,29.08 v1(7.57,33.3)
  vias: v1(1.22,39.65) v1(1.22,38.38) v1(1.22,37.11) v1(2.49,39.65) v1(2.49,38.38) v1(2.49,37.11) v1(3.76,39.65) v1(3.76,38.38) v1(3.76,37.11) v1(5.03,37.11) v1(6.3,37.11) v1(7.57,37.11) v1(7.57,35.84) v1(7.57,34.57) v1(17.5,24.23) v1(44.95,43.1) v1(44.95,41.83) v1(44.95,40.56) v1(44.95,39.29) v1(44.95,38.02) v1(46.22,43.1) v1(46.22,41.83) v1(46.22,40.56) v1(46.22,39.29) v1(46.22,38.02) v1(47.49,43.1) v1(47.49,41.83) v1(47.49,40.56) v1(47.49,39.29) v1(47.49,38.02) v1(47.49,36.75) v1(47.49,34.21) v1(47.49,32.94) v1(47.49,31.67) v1(48.76,43.1) v1(48.76,41.83) v1(48.76,40.56) v1(48.76,39.29) v1(48.76,38.02) v1(48.76,36.75) v1(48.76,34.21) v1(50.03,39.29) v1(50.03,38.02) v1(50.03,36.75) v1(50.03,35.48) v1(50.03,34.21) v1(50.03,32.94) v1(51.3,39.29) v1(51.3,38.02) v1(51.3,36.75) v1(51.3,35.48) v1(51.3,34.21) v1(51.3,32.94) v1(51.3,31.67)
GND:
  vias: v1(3.63,21.03) v1(3.63,16.97) v1(3.63,11.89) v1(8.71,22.05) v1(8.71,11.89) v1(8.71,1.73) v1(13.79,27.13) v1(13.79,22.05) v1(14.98,31.44) v1(18.92,17.07) v1(18.87,11.89) v1(23.95,11.89) v1(23.95,6.81) v1(32.54,33.99) v1(33.5,34.75) v1(33.86,33.53) v1(34.11,22.05) v1(34.11,6.81) v1(35.69,28.45) v1(39.19,27.13) v1(44.27,6.81) v1(44.27,1.73) v1(49.35,6.81)
IN1: length 21.9
  Top Layer w0.254: 34.73,25.07 34.7,25.04 v1(32.79,25.04)
  Top Layer w0.305: SW2.5 29.65,9.44 v1(29.64,9.45)
  Bottom Layer w0.254: v1(32.79,25.04) 30.25,25.04 29.64,24.44 v1(29.64,9.45)
IN1_INSIDE: length 9.8
  Top Layer w0.305: 40,7.85 40,8.48 39.24,9.25 32.89,9.25 32.15,8.51 SW2.4
IN1_OUTSIDE: length 22.2
  Top Layer w0.305: SW2.6 27.15,8.43 26.19,9.4 9.22,9.4 8.51,8.69 H1.3
IN2: length 38.2
  Top Layer w0.254: U2.2 16.66,26.37 v1(15.16,26.37) ; v1(19.18,24.89) 22.94,24.89 v1(22.99,24.84)
  Top Layer w0.305: v1(29.64,4.12) 29.65,4.1 SW2.2
  Bottom Layer w0.254: v1(19.18,24.89) 17.7,26.37 v1(15.16,26.37) ; v1(22.99,24.84) 27.81,24.84 28.42,24.23 28.42,5.33 v1(29.64,4.12)
IN2_INSIDE: length 10.4
  Top Layer w0.305: SW2.1 32.15,1.2 32.84,0.51 39.34,0.51 40,1.17 SW3.2
IN2_OUTSIDE: length 27.3
  Top Layer w0.305: H1.2 5.97,1.68 7.04,0.61 26.14,0.61 27.15,1.63 SW2.3
M1_-: length 5.8
  Top Layer w0.305: R32.2 20.05,37.55 U9.2
PWM: length 23.6
  Top Layer w0.305: SW3.3 37.5,3.85 38.79,5.13 41.58,5.13 42.5,6.06 42.5,7.85 40.97,9.39 40.97,16.37 41.88,17.29 41.88,21.07
SD1: length 41.3
  Top Layer w0.254: v1(36.19,26.31) 34.75,26.31 U1.3
  Top Layer w0.305: v1(20.55,5.23) 19.89,5.23 19.33,5.79 19.33,7.93
  Bottom Layer w0.254: v1(20.55,5.23) 20.55,25.4 21.46,26.31 v1(36.19,26.31)
SD2: length 30.7
  Top Layer w0.254: U2.3 16.66,27.64 v1(15.37,27.64)
  Top Layer w0.305: 19.33,2.23 v1(19.33,4.27)
  Bottom Layer w0.254: v1(19.33,4.27) 19.89,4.83 19.89,26.37 18.62,27.64 v1(15.37,27.64)
$1N6: length 6.4
  Top Layer w0.254: D5.1 12.33,24.5 11.74,25.09 U2.8 10.85,25.07 8.93,25.07 C9.1
$1N7: length 8.8
  Top Layer w0.254: v1(9.6,25.7) 10.25,26.36 U2.7 ; R6.1 3.67,25.68 D3.1 v1(6.43,25.68)
  Bottom Layer w0.254: v1(6.43,25.68) 6.45,25.7 v1(9.6,25.7)
$1N10: length 14.5
  Top Layer w0.254: R10.1 21.14,27.34 20.54,26.74 D7.1 19.06,28.06 16.97,30.15 11.51,30.15 10.87,29.51 U2.5
$1N13: length 10.9
  Top Layer w0.254: D7.2 19.47,29.71 R10.2
  Top Layer w0.305: Q8.1 13.56,33.2 14.16,32.6 17.91,32.6 R12.1 19.06,31.45 D7.2
$1N17: length 7.8
  Top Layer w0.254: U1.8 27.38,23.8 26.24,24.94 26.24,26.55 24.52,28.27 C8.1
$1N19: length 6.2
  Top Layer w0.254: D6.1 28.93,28.88 U1.5 31.19,27.61 32.32,28.74 R9.1
$1N21: length 12.2
  Top Layer w0.254: 28.93,25.07 30.8,25.07 34.53,28.8 R5.1 36.49,29.67 37.29,28.88 D2.1
$1N1054: length 2
  Top Layer w0.254: U4.3 20.37,16.48 19.79,15.9 R13.2
$1N1080: length 1.7
  Top Layer w0.254: 26.93,20.7 26.93,19.09 U4.8
$1N1130: length 2.4
  Top Layer w0.254: C12.1 29.12,16.48 U4.6
$1N2120: length 2.6
  Top Layer w0.254: LED1.2 39.56,10.83 R18.1
$1N11802: length 2.1
  Top Layer w0.305: R32.1 21.56,34.18 LED2.2
$1N11897: length 1.9
  Top Layer w0.305: LED3.2 24.29,34.97 R33.1
$2N434: length 10.4
  Top Layer w0.254: 44.42,21.07 v1(44.42,22.86)
  Bottom Layer w0.254: R26.2 45.11,29.64 44.42,28.96 v1(44.42,22.86)
$2N438: length 14.3
  Top Layer w0.305: 49.05,5.18 R31.2 44.86,7.72 41.88,10.69 U10.8
$2N446: length 24.5
  Top Layer w0.254: 44.42,15.61 44.42,17.17 45.49,18.24 50.77,18.24 51.79,19.25 R30.1
  Top Layer w0.305: 49.05,10.26 50.16,11.38 50.16,13.41 49.45,14.12 44.83,14.12 44.42,14.53 U10.10
$2N452: length 15.6
  Top Layer w0.254: 51.79,24.48 51.68,24.59 C20.2 49.5,24.45 49.5,19.51 48.84,18.85 44.07,18.85 43.15,19.76 43.15,21.07
$2N464: length 18
  Top Layer w0.254: v1(45.59,19.46) 46.56,19.46 46.96,19.86 46.96,23.87 R27.1 ; 43.15,15.61 v1(43.15,18.39)
  Top Layer w0.305: C21.2 46.57,12.7 R28.2 43.15,14.06 U10.9
  Bottom Layer w0.254: v1(45.59,19.46) 43.66,19.46 43.15,18.95 v1(43.15,18.39)
$2N473: length 17.9
  Top Layer w0.254: C20.1 48.25,21.08 48.23,21.07 v1(48.23,19.46)
  Top Layer w0.305: R29.1 43.82,10.26 v1(46.2,10.26)
  Bottom Layer w0.254: v1(46.2,10.26) 46.66,10.26 48.23,11.84 v1(48.23,19.46)

## Copper pours and planes (outline as drawn; the poured copper is in the pictures)
12V on Top Layer: 5.92,30.79 5.92,35.99 -0.05,35.99 -0.05,45.26 10.91,45.26 10.91,37.48 10.82,37.39 8.2,37.39 8.2,30.76 5.95,30.76
12V on Top Layer: 14.96,23.59 14.96,21.73 17.1,21.73 17.15,21.69 17.15,22.65 18.66,22.65 18.66,25.26 23.9,25.26 23.9,27.48 23.85,27.53 21.35,27.53 21.35,25.96 14.96,25.96 14.96,23.59
12V on Top Layer: 29.84,15.48 29.84,11.59 29.84,11.58 38.43,11.58 38.48,11.63 38.48,15.8 40.06,15.8 40.06,23.62 45.29,23.62 45.29,20.04 46.1,20.04 46.1,23.61 45.59,24.49 45.59,25.1 45.54,25.15 39.03,25.15 39.03,24.59 33.83,24.59 33.83,23.2 37.62,23.2 37.62,15.49 37.6,15.48
12V on Top Layer: 37.33,44.5 37.33,37.39 46.94,37.39 46.94,30.4 53.42,30.4 53.42,44.5
12V on Bottom Layer: 0.15,44.5 0.15,37.39 46.94,37.39 46.94,30.4 53.42,30.4 53.42,44.5
12V on Bottom Layer: 5.92,30.79 5.92,35.99 -0.05,35.99 -0.05,45.26 10.91,45.26 10.91,37.48 10.82,37.39 8.2,37.39 8.2,30.76 5.95,30.76
GND on Top Layer: -70.99,43.48 -13.59,43.48 -13.59,-4.93 -70.99,-4.93
GND on Bottom Layer: -5.82,48.51 58.9,48.51 58.9,-8.99 -5.82,-8.99
VCC on Top Layer: 12.37,16.82 16.72,16.82 16.72,20.17 25.68,20.17 25.68,15.08 22.07,15.08 22.07,18.54 18.39,18.54 18.39,13.41 12.37,13.41
M1_+ on Top Layer: 24.73,45.26 24.73,29.6 25.21,29.6 25.21,27.52 25.08,27.39 27,27.39 27,25.45 30.24,25.45 30.24,27.23 27.95,27.23 27.95,35.87 41.48,35.87 41.48,30.4 46.69,30.4 46.69,37.14 37.03,37.14 37.03,45.26
M1_- on Top Layer: 7.54,26.38 11.77,26.38 11.77,36.12 24.08,36.12 24.08,45.26 10.89,45.26 10.89,37.38 7.58,37.38 7.57,37.39 7.57,26.41
$1N8 on Top Layer: 6.05,35.74 6.05,30.66 7.54,30.66 7.54,28.4 7.57,28.37 3.38,28.37 3.38,27.81 0,27.81 -0.05,27.86 -0.05,35.74
$1N16 on Top Layer: 28.14,35.61 28.14,31.8 30.06,31.8 30.06,28.87 31.57,28.87 31.57,35.61
$1N20 on Top Layer: 33.74,32.07 33.74,30.43 41.31,30.43 41.31,35.62 37.54,35.62 37.54,32.07
$1N1292 on Top Layer: 23.72,23.29 23.72,21.26 27.68,21.26 27.68,18.48 26,18.48 26,17.12 30.52,17.12 30.52,15.82 33.47,15.82 33.47,19.27 29.05,19.27 29.05,22.02 25.7,22.02 25.7,23.29
$1N2220 on Top Layer: 26.28,15.49 26.28,13.66 26.53,13.4 26.53,9.87 26.69,9.88 27.67,9.88 27.67,11.91 29.54,11.91 29.54,15.52 29.52,15.49

## Text on the board
Bottom Silkscreen Layer: DC MOTOR DRIVER
Top Silkscreen Layer: G IN2 IN1 V | ON  OFF | OUT      IN
